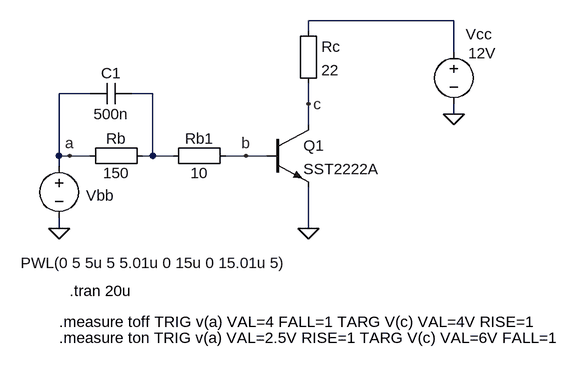
[diagram p0: schematic BT-CE-SWITCH-CAP.asc]
BT-CE-SWITCH-CAP.asc, the LTspice schematic file:
Version 4
SHEET 1 880 680
WIRE 544 -112 320 -112
WIRE 320 -96 320 -112
WIRE 544 -64 544 -112
WIRE -16 0 -64 0
WIRE 80 0 48 0
WIRE 320 16 320 -16
WIRE 544 32 544 16
WIRE 320 48 320 16
WIRE -64 96 -64 0
WIRE -48 96 -64 96
WIRE -16 96 -48 96
WIRE 80 96 80 0
WIRE 80 96 64 96
WIRE 112 96 80 96
WIRE 224 96 192 96
WIRE 256 96 224 96
WIRE -64 112 -64 96
WIRE -64 208 -64 192
WIRE 320 208 320 144
WIRE 0 0 0 0
FLAG 320 208 0
FLAG -64 208 0
FLAG 544 32 0
FLAG 224 96 b
FLAG 320 16 c
FLAG -48 96 a
SYMBOL Misc\\EuropeanResistor 304 -112 R0
SYMATTR InstName Rc
SYMATTR Value 22
SYMBOL Misc\\EuropeanResistor 80 80 R90
WINDOW 0 5 56 VBottom 2
WINDOW 3 27 56 VTop 2
SYMATTR InstName Rb
SYMATTR Value 150
SYMBOL voltage -64 96 R0
WINDOW 3 -59 165 Left 2
WINDOW 123 0 0 Left 2
WINDOW 39 0 0 Left 2
WINDOW 0 42 61 Left 2
SYMATTR Value PWL(0 5 5u 5 5.01u 0 15u 0 15.01u 5)
SYMATTR InstName Vbb
SYMBOL voltage 544 -80 R0
WINDOW 3 22 18 Left 2
WINDOW 123 0 0 Left 2
WINDOW 39 0 0 Left 2
WINDOW 0 18 -11 Left 2
SYMATTR Value 12V
SYMATTR InstName Vcc
SYMBOL npn 256 48 R0
SYMATTR InstName Q1
SYMATTR Value SST2222A
SYMBOL Misc\\EuropeanResistor 208 80 R90
WINDOW 0 5 56 VBottom 2
WINDOW 3 27 56 VTop 2
SYMATTR InstName Rb1
SYMATTR Value 10
SYMBOL cap 48 -16 R90
WINDOW 0 0 32 VBottom 2
WINDOW 3 32 32 VTop 2
SYMATTR InstName C1
SYMATTR Value 500n
TEXT -48 304 Left 2 !.tran 20u
TEXT -64 352 Left 2 !.measure toff TRIG v(a) VAL=4 FALL=1 TARG V(c) VAL=4V RISE=1
TEXT -64 376 Left 2 !.measure ton TRIG v(a) VAL=2.5V RISE=1 TARG V(c) VAL=6V FALL=1

The netlist it stands for:
* BT-CE-SWITCH-CAP.asc
Rc N001 c 22
Rb N002 a 150
Vbb a 0 PWL(0 5 5u 5 5.01u 0 15u 0 15.01u 5)
Vcc N001 0 12V
Q1 c b 0 0 SST2222A
Rb1 b N002 10
C1 N002 a 500n
.model NPN NPN
.model PNP PNP
.lib standard.bjt
.tran 20u
.measure toff TRIG v(a) VAL=4 FALL=1 TARG V(c) VAL=4V RISE=1
.measure ton TRIG v(a) VAL=2.5V RISE=1 TARG V(c) VAL=6V FALL=1
.backanno
.end